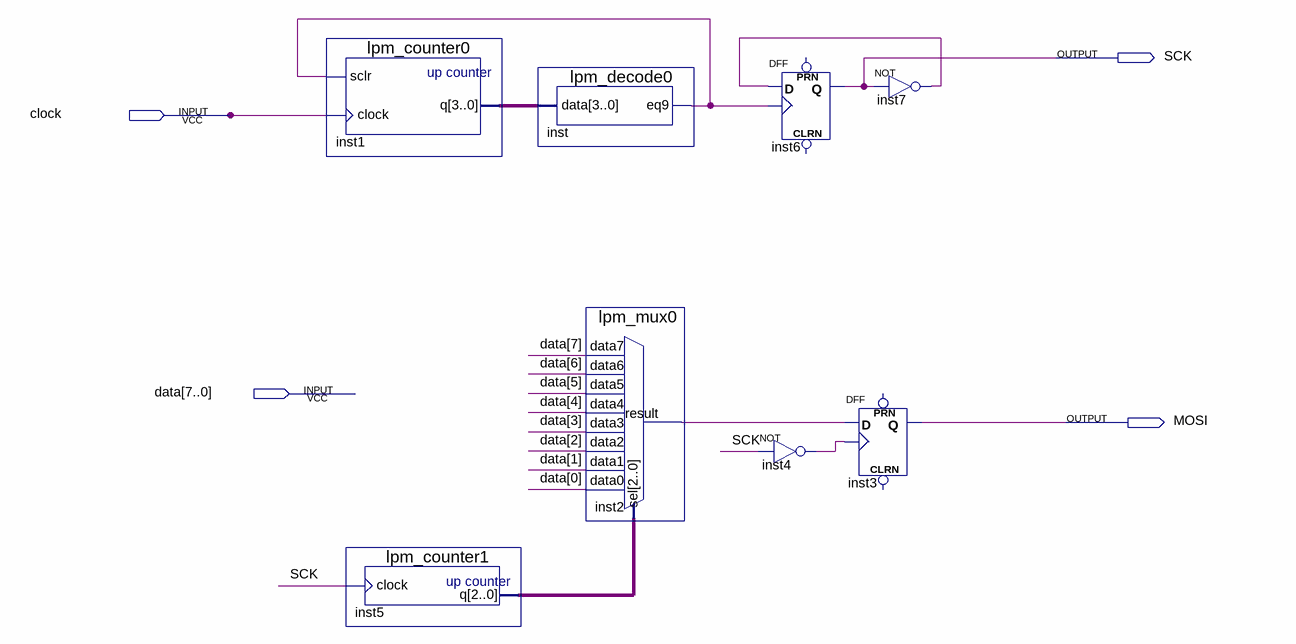
[diagram p0: schematic sheet]
// Quartus schematic spi.bdf as structural Verilog: 8 symbols, 4 pins
module spi (
  input  clock,
  input  [7:0] data,
  output SCK,
  output MOSI
);

  wire inst2_result, inst4_out, inst7_out, inst_eq9;
  wire [2:0] inst5_q;
  wire [3:0] inst1_q;

  lpm_counter0 inst1 (.sclr(inst_eq9), .clock(clock), .q(inst1_q));
  lpm_counter1 inst5 (.clock(SCK), .q(inst5_q));
  lpm_decode0 inst (.data(inst1_q), .eq9(inst_eq9));
  lpm_mux0 inst2 (
    .data7(data[7]), .data6(data[6]), .data5(data[5]), .data4(data[4]), .data3(data[3]), .data2(data[2]),
    .data1(data[1]), .data0(data[0]), .sel(inst5_q), .result(inst2_result));
  DFF inst6 (.CLK(inst_eq9), .D(inst7_out), .Q(SCK));  // open: CLRN, PRN
  not inst4 (inst4_out, SCK);
  not inst7 (inst7_out, SCK);
  DFF inst3 (.CLK(inst4_out), .D(inst2_result), .Q(MOSI));  // open: CLRN, PRN
endmodule
